# EAGLE design electricRayBot2 (EAGLE 6.4)

## Sheet 1 of 2
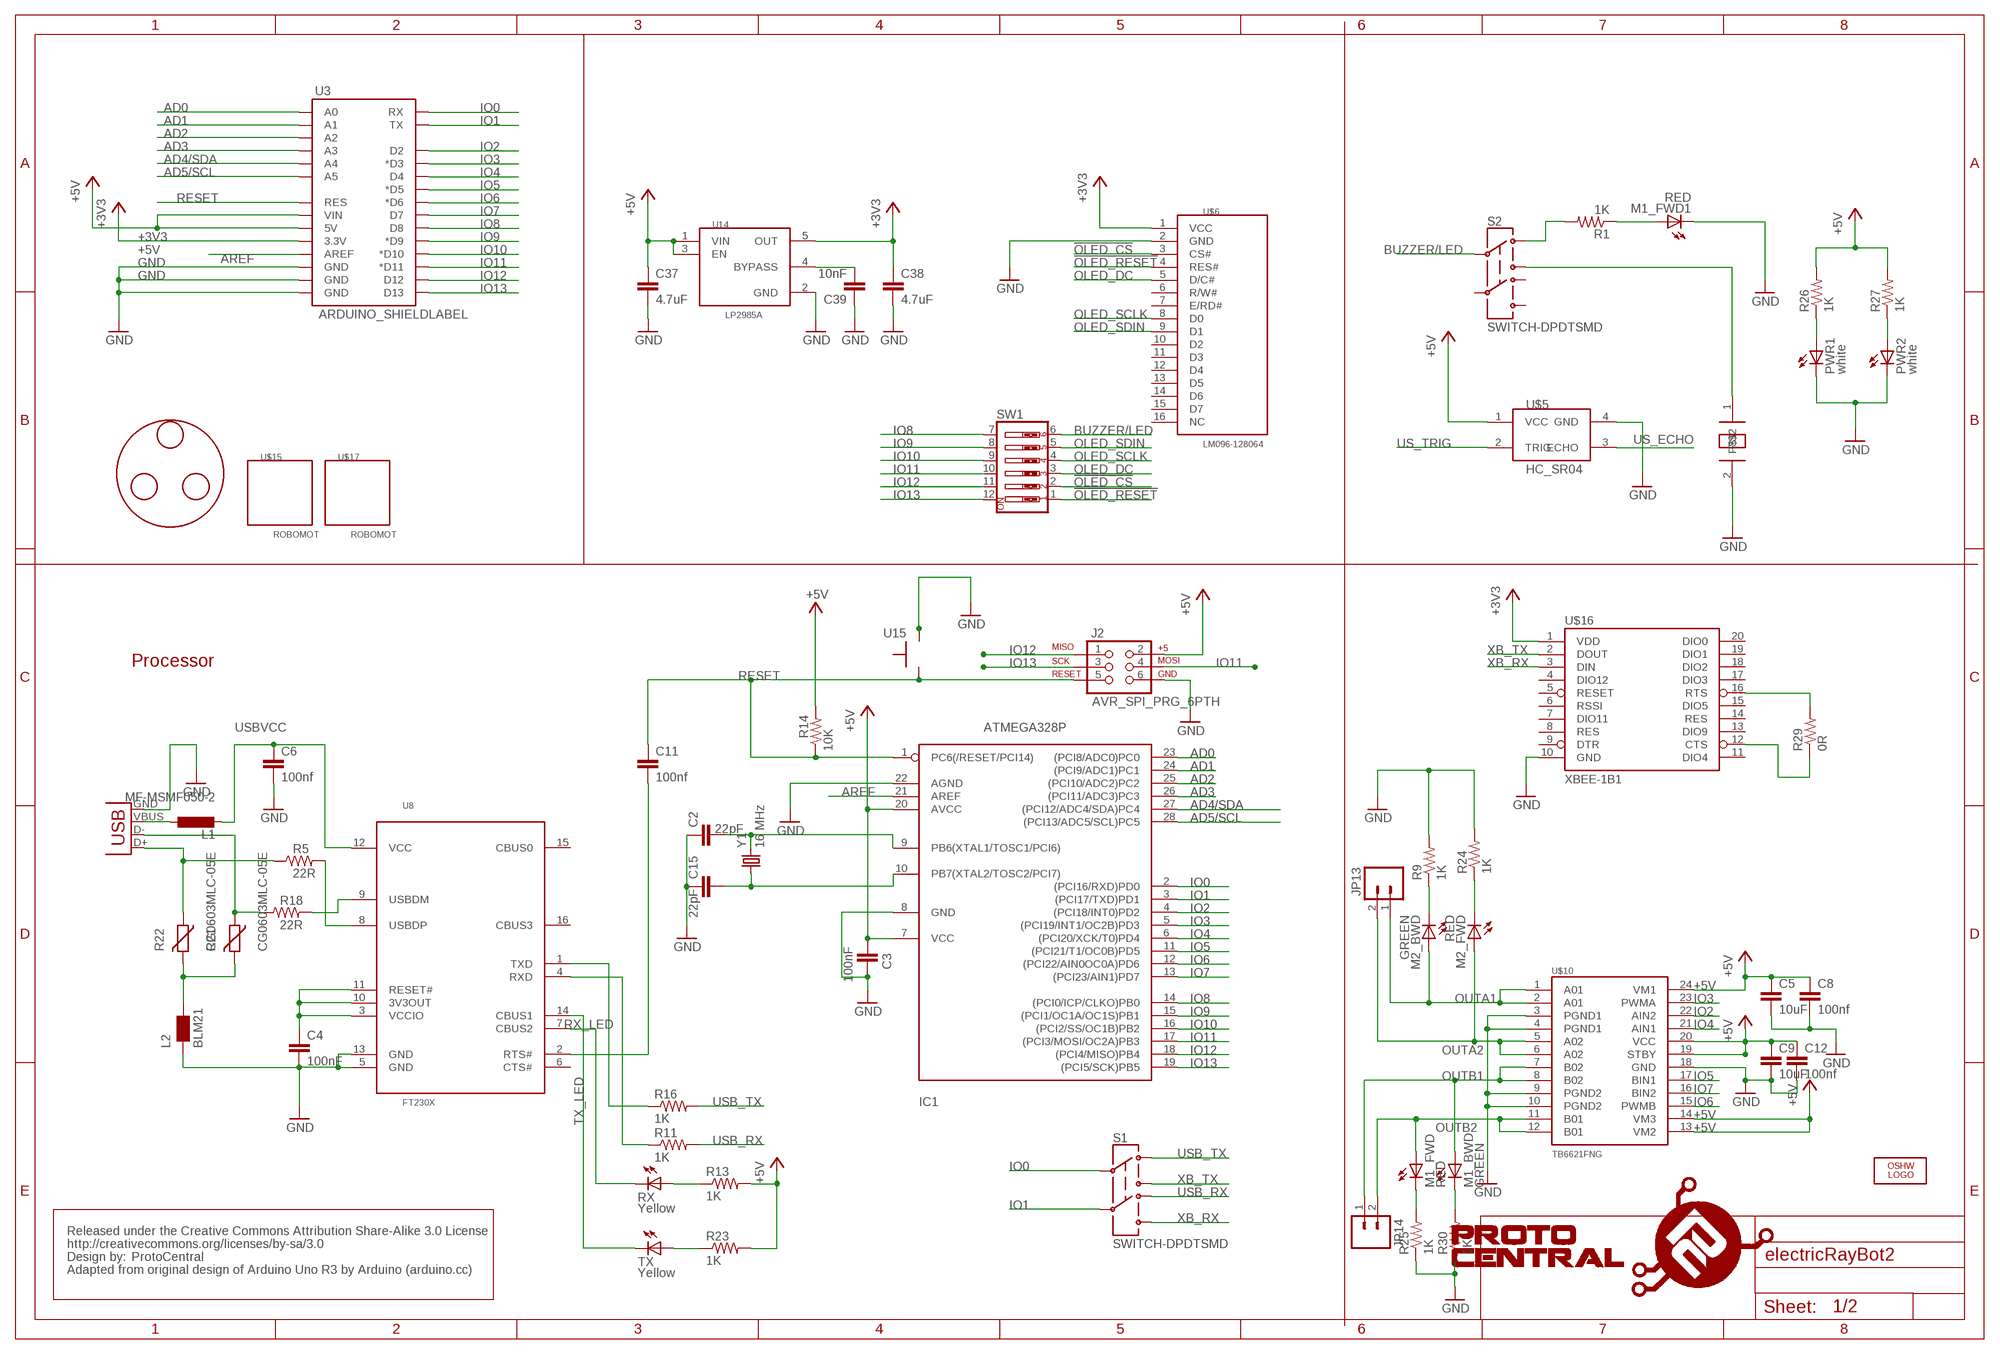
[diagram p0: schematic, sheet 1]

### Parts
C2  22pF  C-EUC0402  [C0402]
C3  100nF  C-EUC0805  [C0805]
C4  100nF  C-EUC0805  [C0805]
C5  10uF  C-EUC0805  [C0805]
C6  100nf  C-EUC0805  [C0805]
C8  100nf  C-EUC0805  [C0805]
C9  10uF  C-EUC0805  [C0805]
C11  100nf  C-EUC0805  [C0805]
C12  100nf  C-EUC0805  [C0805]
C15  22pF  C-EUC0402  [C0402]
C37  4.7uF  C-EUC0805  [C0805]
C38  4.7uF  C-EUC0805  [C0805]
C39  10nF  C-EUC0805  [C0805]
IC1  ATMEGA328P  [DIP28]
J2  AVR_SPI_PRG_6PTH  [2X3]
JP13  M023.5MM  [SCREWTERMINAL-3.5MM-2]
JP14  M023.5MM  [SCREWTERMINAL-3.5MM-2]
L1  MF-MSMF050-2  L-EUL1812  [L1812]
L2  BLM21  WE-CBF_0805  [0805]
LOGO2  OSHW_LOGO_FILLX0350-NT  [OSHW_FILLX350_NOTEXT]
M1_BWD  GREEN  LEDCHIPLED_0603  [CHIPLED_0603]
M1_FWD  RED  LEDCHIPLED_0603  [CHIPLED_0603]
M1_FWD1  RED  LEDCHIPLED_0603  [CHIPLED_0603]
M2_BWD  GREEN  LEDCHIPLED_0603  [CHIPLED_0603]
M2_FWD  RED  LEDCHIPLED_0603  [CHIPLED_0603]
PWR1  white  LED0603  [LED-0603]
PWR2  white  LED0603  [LED-0603]
R1  1K  R-US_R0805  [R0805]
R5  22R  R-US_R0805  [R0805]
R9  1K  R-US_R0805  [R0805]
R11  1K  R-US_R0805  [R0805]
R13  1K  R-US_R0805  [R0805]
R14  10K  R-US_R0805  [R0805]
R16  1K  R-US_R0805  [R0805]
R18  22R  R-US_R0805  [R0805]
R21  CG0603MLC-05E  VARISTORCN0603  [CT/CN0603]
R22  CG0603MLC-05E  VARISTORCN0603  [CT/CN0603]
R23  1K  R-US_R0805  [R0805]
R24  1K  R-US_R0805  [R0805]
R25  1K  R-US_R0805  [R0805]
R26  1K  R-US_R0805  [R0805]
R27  1K  R-US_R0805  [R0805]
R29  0R  R-US_R0805  [R0805]
R30  1K  R-US_R0805  [R0805]
RX  Yellow  LEDCHIPLED_0603  [CHIPLED_0603]
S1  SWITCH-DPDTSMD  [AYZ0202]
S2  SWITCH-DPDTSMD  [AYZ0202]
SW1  SW_DIP-6  [EDG-06]
TX  Yellow  LEDCHIPLED_0603  [CHIPLED_0603]
U3  ARDUINO_SHIELDLABEL  [DUEMILANOVE_SHIELD]
U8  FT230X  [SSOP_16]
U14  LP2985A  [SOT23-5]
U15  EVQQ2  [EVQQ2]
U$1  CREATIVE_COMMONS  [CREATIVE_COMMONS]
U$4  PS1740  [PS02]
U$5  HC_SR04  [ULTRA]
U$6  LM096-128064  [LM096-128064(OLED)]
U$10  TB6621FNG  [SSOP24]
U$15  ROBOMOT  [ROBOMOT]
U$16  XBEE-1B1  [XBEE-1]
U$17  ROBOMOT  [ROBOMOT]
U$18  PROTY-LOGO  [LOGO-PROTY]
U$20  MOTO  [MOTO]
X1  USBPTH  [USB-B-PTH]
Y1  16 MHz  CRYSTALHC49US  [HC49US]

### Nets
!OLED_CS: SW1.2 U$6.3(CS#)
!OLED_RESET: SW1.1 U$6.4(RES#)
+3V3: C38.1 U3.3.3V U14.5(OUT) U$6.1(VCC) U$16.1(VDD)
+5V: C3.1 C5.1 C8.1 C9.1 C12.1 C37.1 IC1.7(VCC) IC1.20(AVCC) J2.2 R13.2 R14.2 R23.2 R26.2 R27.2 U3.5V U3.VIN U14.1(VIN) U14.3(EN) U$5.1(VCC) U$10.13(VM2) U$10.14(VM3) U$10.19(STBY) U$10.20(VCC) U$10.24(VM1) ; also sheet 2
AD0: IC1.23((PCI8/ADC0)PC0) U3.A0 ; also sheet 2
AD1: IC1.24((PCI9/ADC1)PC1) U3.A1 ; also sheet 2
AD2: IC1.25((PCI10/ADC2)PC2) U3.A2 ; also sheet 2
AD3: IC1.26((PCI11/ADC3)PC3) U3.A3 ; also sheet 2
AD4/SDA: IC1.27((PCI12/ADC4/SDA)PC4) U3.A4 ; also sheet 2
AD5/SCL: IC1.28((PCI13/ADC5/SCL)PC5) U3.A5 ; also sheet 2
AREF: IC1.21(AREF) U3.AREF
BUZZER: S2.3 U$4.1
BUZZER/LED: S2.2 SW1.6
GND: C2.1 C3.2 C4.2 C5.2 C6.2 C8.2 C9.2 C12.2 C15.1 C37.2 C38.2 C39.1 IC1.8(GND) IC1.22(AGND) J2.6 L2.1 M1_FWD1.C PWR1.C PWR2.C R9.2 R24.2 R25.1 R30.1 U3.GND@0(GND) U3.GND@1(GND) U3.GND@2(GND) U8.5(GND) U8.13(GND) U14.2(GND) U15.P$3 U$4.2 U$5.4(GND) U$6.2(GND) U$10.3(PGND1) U$10.4(PGND1) U$10.9(PGND2) U$10.10(PGND2) U$10.18(GND) U$16.10(GND) X1.GND ; also sheet 2
IO0: IC1.2((PCI16/RXD)PD0) S1.2 U3.RX
IO1: IC1.3((PCI17/TXD)PD1) S1.5 U3.TX
IO2: IC1.4((PCI18/INT0)PD2) U3.D2 U$10.22(AIN2)
IO3: IC1.5((PCI19/INT1/OC2B)PD3) U3.D3(*D3) U$10.23(PWMA)
IO4: IC1.6((PCI20/XCK/T0)PD4) U3.D4 U$10.21(AIN1)
IO5: IC1.11((PCI21/T1/OC0B)PD5) U3.D5(*D5) U$10.17(BIN1)
IO6: IC1.12((PCI22/AIN0OC0A)PD6) U3.D6(*D6) U$10.15(PWMB)
IO7: IC1.13((PCI23/AIN1)PD7) U3.D7 U$10.16(BIN2)
IO8: IC1.14((PCI0/ICP/CLKO)PB0) SW1.7 U3.D8
IO9: IC1.15((PCI1/OC1A/OC1S)PB1) SW1.8 U3.D9(*D9)
IO10: IC1.16((PCI2/SS/OC1B)PB2) SW1.9 U3.D10(*D10)
IO11: IC1.17((PCI3/MOSI/OC2A)PB3) J2.4 SW1.10 U3.D11(*D11)
IO12: IC1.18((PCI4/MISO)PB4) J2.1 SW1.11 U3.D12
IO13: IC1.19((PCI5/SCK)PB5) J2.3 SW1.12 U3.D13
N$1: PWR1.A R26.1
N$8: M1_FWD1.A R1.1
N$10: M2_BWD.C R9.1
N$11: PWR2.A R27.1
N$14: R18.2 U8.9(USBDM)
N$15: C4.1 U8.3(VCCIO) U8.10(3V3OUT) U8.11(RESET#)
N$16: R18.1 R21.1 X1.D-
N$17: R5.2 U8.8(USBDP)
N$18: L1.1 X1.VBUS
N$20: M1_FWD.C R25.2
N$23: M1_BWD.C R30.2
N$24: R29.2 U$16.16(RTS)
N$25: C39.2 U14.4(BYPASS)
N$28: R29.1 U$16.12(CTS)
N$29: M2_FWD.C R24.1
N$30: R1.2 S2.1
N$35: R16.1 U8.1(TXD)
N$37: R11.1 U8.4(RXD)
N$40: R13.1 RX.A
N$41: R23.1 TX.A
N$44: C2.2 IC1.9(PB6(XTAL1/TOSC1/PCI6)) Y1.2
N$45: C15.2 IC1.10(PB7(XTAL2/TOSC2/PCI7)) Y1.1
N$46: C11.2 U8.2(RTS#)
N$64: L2.2 R21.2 R22.2
N$73: R5.1 R22.1 X1.D+
OLED_DC: SW1.3 U$6.5(D/C#)
OLED_SCLK: SW1.4 U$6.8(D0)
OLED_SDIN: SW1.5 U$6.9(D1)
OUTA1: JP13.1 M2_BWD.A U$10.1(A01) U$10.2(A01)
OUTA2: JP13.2 M2_FWD.A U$10.5(A02) U$10.6(A02)
OUTB1: JP14.1 M1_BWD.A U$10.7(B02) U$10.8(B02)
OUTB2: JP14.2 M1_FWD.A U$10.11(B01) U$10.12(B01)
RESET: C11.1 IC1.1(PC6(/RESET/PCI14)) J2.5 R14.1 U3.RES U15.P$1
RX_LED: RX.C U8.7(CBUS2)
TX_LED: TX.C U8.14(CBUS1)
US_ECHO: U$5.3(ECHO) ; also sheet 2
US_TRIG: U$5.2(TRIG) ; also sheet 2
USB_RX: R11.2 S1.4
USB_TX: R16.2 S1.1
USBVCC: C6.1 L1.2 U8.12(VCC) ; also sheet 2
XB_RX: S1.6 U$16.3(DIN)
XB_TX: S1.3 U$16.2(DOUT)
Unconnected: S2.4 S2.5 S2.6 U8.6(CTS#) U8.15(CBUS0) U8.16(CBUS3) U$6.6(R/W#) U$6.7(E/RD#) U$6.10(D2) U$6.11(D3) U$6.12(D4) U$6.13(D5) U$6.14(D6) U$6.15(D7) U$6.16(NC) U$16.4(DIO12) U$16.5(RESET) U$16.6(RSSI) U$16.7(DIO11) U$16.8(RES) U$16.9(DTR) U$16.11(DIO4) U$16.13(DIO9) U$16.14(RES) U$16.15(DIO5) U$16.17(DIO3) U$16.18(DIO2) U$16.19(DIO1) U$16.20(DIO0)

### Notes on the sheet
- Processor
- ProtoCentral
- Adapted from original design of Arduino Uno R3 by Arduino (arduino.cc)

## Sheet 2 of 2
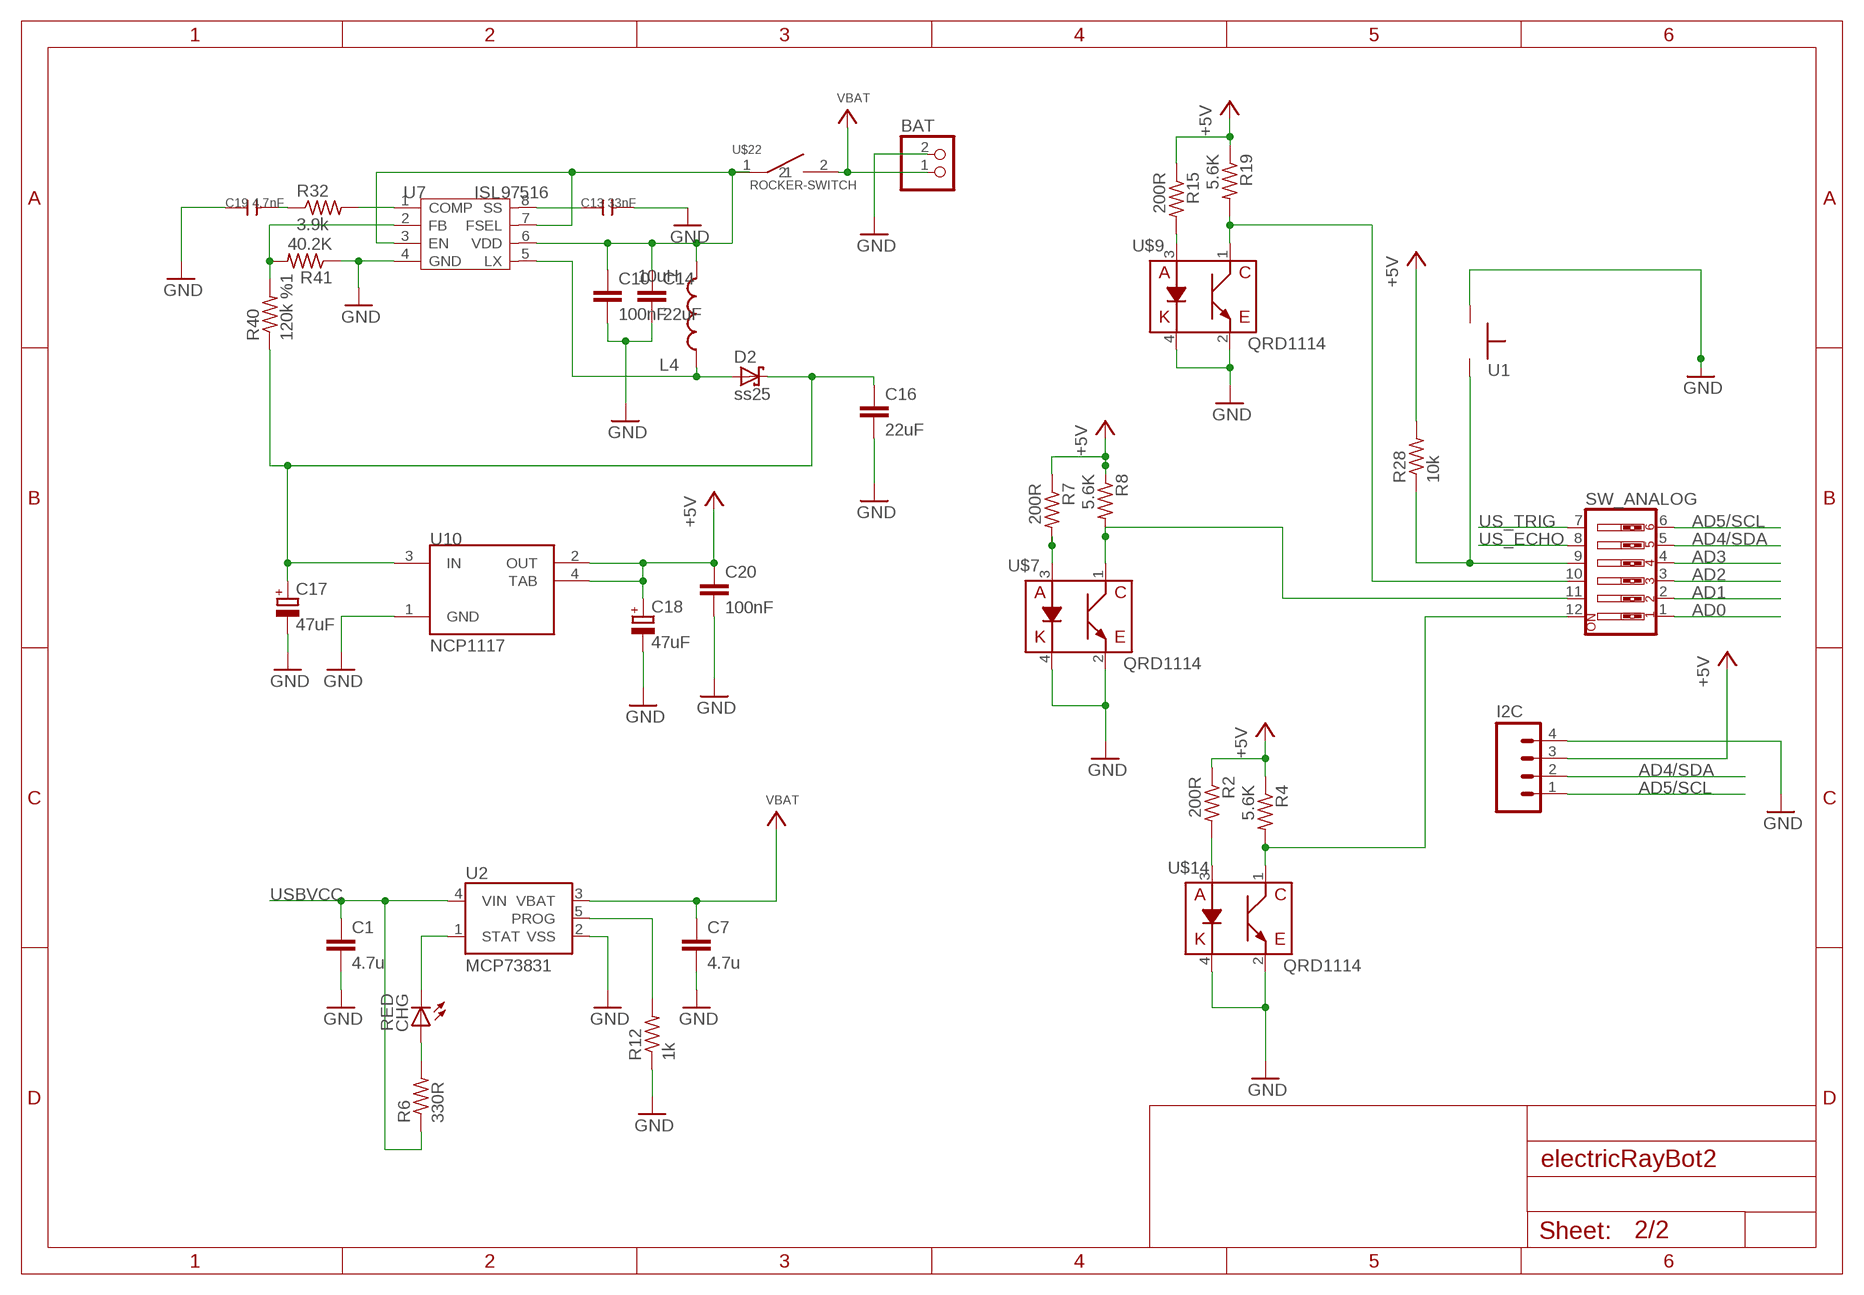
[diagram p1: schematic, sheet 2]

### Parts
BAT  JST_2PIN-THM  [JST-PH-2-THM]
C1  4.7u  C-EUC0805  [C0805]
C7  4.7u  C-EUC0805  [C0805]
C10  100nF  C-EUC0805  [C0805]
C13  33nF  C-0603  [C0603]
C14  22uF  C-EUC1206  [C1206]
C16  22uF  C-EUC1206  [C1206]
C17  47uF  CPOL-EUD  [PANASONIC_D]
C18  47uF  CPOL-EUD  [PANASONIC_D]
C19  4.7nF  C-0603  [C0603]
C20  100nF  C-EUC0402  [C0402]
CHG  RED  LEDCHIPLED_0603  [CHIPLED_0603]
D2  ss25  SCHOTTKY-DIODESMD  [SMB]
I2C  M04POLAR_LOCK  [MOLEX-1X4_LOCK]
L4  10uH  CDRH8D43  [CDRH8D43]
R2  200R  R-US_R0805  [R0805]
R4  5.6K  R-US_R0805  [R0805]
R6  330R  R-US_R0805  [R0805]
R7  200R  R-US_R0805  [R0805]
R8  5.6K  R-US_R0805  [R0805]
R12  1k  R-US_R0805  [R0805]
R15  200R  R-US_R0805  [R0805]
R19  5.6K  R-US_R0805  [R0805]
R28  10k  R-US_R0805  [R0805]
R32  3.9k  R-US_R0805  [R0805]
R40  120k %1  R-US_R0805  [R0805]
R41  40.2K  R-US_R0805  [R0805]
SW_ANALOG  SW_DIP-6  [EDG-06]
U1  EVQQ2  [EVQQ2]
U2  MCP73831  [SOT23-5]
U7  ISL97516  [MSOP8]
U10  NCP1117  [SOT223]
U$7  QRD1114  [QRD1114]
U$9  QRD1114  [QRD1114]
U$14  QRD1114  [QRD1114]
U$22  ROCKER-SWITCH  [SPST(RIGHT-ANGLE)]

### Nets
+5V: C18.+ C20.1 I2C.3 R2.1 R4.1 R7.1 R8.1 R15.1 R19.1 R28.2 U10.2(OUT) U10.4(TAB) ; also sheet 1
AD0: SW_ANALOG.1 ; also sheet 1
AD1: SW_ANALOG.2 ; also sheet 1
AD2: SW_ANALOG.3 ; also sheet 1
AD3: SW_ANALOG.4 ; also sheet 1
AD4/SDA: I2C.2 SW_ANALOG.5 ; also sheet 1
AD5/SCL: I2C.1 SW_ANALOG.6 ; also sheet 1
GND: BAT.2 C1.2 C7.2 C10.2 C13.2 C14.2 C16.2 C17.- C18.- C19.1 C20.2 I2C.4 R12.1 R41.1 U1.P$1 U2.2(VSS) U7.4(GND) U10.1(GND) U$7.2(C) U$7.4(K) U$9.2(C) U$9.4(K) U$14.2(C) U$14.4(K) ; also sheet 1
IR1: R15.2 U$9.3(A)
IR4: R7.2 U$7.3(A)
IR5: R2.2 U$14.3(A)
N$2: CHG.C U2.1(STAT)
N$3: CHG.A R6.2
N$4: R28.1 SW_ANALOG.9 U1.P$3
N$7: C16.1 C17.+ D2.C R40.1 U10.3(IN)
N$12: C13.1 U7.8(SS)
N$13: D2.A L4.P$1 U7.5(LX)
N$19: R12.2 U2.5(PROG)
N$21: R32.2 U7.1(COMP)
N$22: C19.2 R32.1
N$36: R4.2 SW_ANALOG.12 U$14.1(E)
N$39: R8.2 SW_ANALOG.11 U$7.1(E)
N$42: R40.2 R41.2 U7.2(FB)
N$43: R19.2 SW_ANALOG.10 U$9.1(E)
US_ECHO: SW_ANALOG.8 ; also sheet 1
US_TRIG: SW_ANALOG.7 ; also sheet 1
USBVCC: C1.1 R6.1 U2.4(VIN) ; also sheet 1
VBAT: BAT.1 C7.1 U2.3(VBAT) U$22.2
VDD: C10.1 C14.1 L4.P$2 U7.3(EN) U7.6(VDD) U7.7(FSEL) U$22.1

## Library data of the parts
BAT = adafruit:JST_2PIN: JST 2-Pin Connectors of various flavors SMT-RA (S2B-PH-SM4) 4UConnector #17311 SMT (B2B-PH-SM4) THM-RA (S2B-PH) THM (B2B-PH)
C1-C12 C14-C16 C20 C37-C39 = rcl:C-EU: CAPACITOR, European symbol
C13 C19 = Discrete:C*: Ceramic Capacitors
C17 C18 = rcl:CPOL-EU: POLARIZED CAPACITOR, European symbol
CHG M1_BWD M1_FWD M1_FWD1 M2_BWD M2_FWD RX TX = led:LED: LED OSRAM: - CHIPLED LG R971, LG N971, LY N971, LG Q971, LY Q971, LO R971, LY R971 LH N974, LH R974 LS Q976, LO Q976, LY Q976 LO Q996 - Hyper CHIPLED LW Q18S LB Q993, LB Q99A, LB R99A - SideLED LS A670, LO A670, LY A670, LG A670, LP A670 LB A673, LV A673, LT A673, LW A673 LH A674 LY A675 LS A676, LA A676, LO A676, LY A676, LW A676 LS A679, LY A679, LG A679 - Hyper Micro SIDELED® LS Y876, LA Y876, LO Y876, LY Y876 LT Y87S - SmartLED LW L88C, LW L88S LB L89C, LB L89S, LG L890 LS L89K, LO L89K, LY L89K LS L896, LA L896, LO L896, LY L896 - TOPLED LS T670, LO T670, LY T670, LG T670, LP T670 LSG T670, LSP T670, LSY T670, LOP T670, LYG T670 LG T671, LOG T671, LSG T671 LB T673, LV T673, LT T673, LW T673 LH T674 LS T676, LA T676, LO T676, LY T676, LB T676, LH T676, LSB T676, LW T676 LB T67C, LV T67C, LT T67C, LS T67K, LO T67K, LY T67K, LW E67C LS E67B, LA E67B, LO E67B, LY E67B, LB E67C, LV E67C, LT E67C LW T67C LS T679, LY T679, LG T679 LS T770, LO T770, LY T770, LG T770, LP T770 LB T773, LV T773, LT T773, LW T773 LH T774 LS E675, LA E675, LY E675, LS T675 LS T776, LA T776, LO T776, LY T776, LB T776 LHGB T686 LT T68C, LB T68C - Hyper Mini TOPLED® LB M676 - Mini TOPLED Santana® LG M470 LS M47K, LO M47K, LY M47K Source: http://www.osram.convergy.de LUXEON: - LUMILED® LXK2-PW12-R00, LXK2-PW12-S00, LXK2-PW14-U00, LXK2-PW14-V00 LXK2-PM12-R00, LXK2-PM12-S00, LXK2-PM14-U00 LXK2-PE12-Q00, LXK2-PE12-R00, LXK2-PE12-S00, LXK2-PE14-T00, LXK2-PE14-U00 LXK2-PB12-K00, LXK2-PB12-L00, LXK2-PB12-M00, LXK2-PB14-N00, LXK2-PB14-P00, LXK2-PB14-Q00 LXK2-PR12-L00, LXK2-PR12-M00, LXK2-PR14-Q00, LXK2-PR14-R00 LXK2-PD12-Q00, LXK2-PD12-R00, LXK2-PD12-S00 LXK2-PH12-R00, LXK2-PH12-S00 LXK2-PL12-P00, LXK2-PL12-Q00, LXK2-PL12-R00 Source: www.luxeon.com KINGBRIGHT: KA-3528ASYC Source: www.kingbright.com
D2 = diode:SCHOTTKY-DIODE: Schottky Diode
I2C = SparkFun:M04: Header 4 Standard 4-pin 0.1" header. Use with straight break away headers (SKU : PRT-00116), right angle break away headers (PRT-00553), swiss pins (PRT-00743), machine pins (PRT-00117), and female headers (PRT-00115). Molex polarized connector foot print use with SKU : PRT-08231 with associated crimp pins and housings. 1MM SMD Version SKU: PRT-10208
IC1 = circuitects:ATMEGA328P
J2 = SparkFun:AVR_SPI_PRG_6: AVR ISP 6 Pin This is the reduced ISP connector for AVR programming. Common on Arduino. This footprint will take up less PCB space and can be used with a 10-pin to 6-pin adapter such as SKU: BOB-08508
JP13 JP14 = SparkFun:M02: Header 2 Standard 2-pin 0.1" header. Use with straight break away headers (SKU : PRT-00116), right angle break away headers (PRT-00553), swiss pins (PRT-00743), machine pins (PRT-00117), and female headers (PRT-00115). Molex polarized connector foot print use with SKU : PRT-08233 with associated crimp pins and housings.
L1 = rcl:L-EU: INDUCTOR, European symbol
L2 = wuerth-elektronik:WE-CBF: SMD EMI Suppression Ferrite Beads - excellent anti-EMI properties - low DCR - impedances till 3000 ohms - rated current up to 6 A
L4 = circuitects:CDRH8D43
LOGO2 = ohw-logo:OSHW_LOGO_FILL
PWR1 PWR2 = SparkFun:LED: LEDs Standard schematic elements and footprints for 5mm, 3mm, 1206, and 0603 sized LEDs. 5mm - Spark Fun Electronics SKU : COM-00529 (and others)
R1 R2 R4-R9 R11-R16 R18 R19 R23-R30 R32 R40 R41 = rcl:R-US_: RESISTOR, American symbol
R21 R22 = varistor:VARISTOR: VARISTOR
S1 S2 = SparkFun:SWITCH-DPDT: DPDT Version of the COM-00597
SW1 SW_ANALOG = special:SW_DIP-6: DIP SWITCH
U1 U15 = circuitects:EVQQ2
U2 = SparkFun:MCP73831: Microchip's MCP73831 Miniature single cell, fully integrated Li-Ion, Li-polymer charge management controller http://ww1.microchip.com/downloads/en/DeviceDoc/21984a.pdf
U3 = SparkFun:ARDUINO_SHIELD
U7 = IC:ISL97516
U8 = circuitects:FT230X
U10 = circuitects:NCP1117
U14 = circuitects:LP2985A
U$1 = SparkFun:CREATIVE_COMMONS
U$4 = circuitects:PS1740
U$5 = circuitects:HC_SR04
U$6 = circuitects:LM096-128064
U$7 U$9 U$14 = SparkFun:QRD1114
U$10 = SparkFun:TB6621FNG: Toshiba 1A motor driver
U$15 U$17 = circuitects:ROBOMOT
U$16 = SparkFun:XBEE-1
U$18 = circuitects:PROTY-LOGO
U$20 = circuitects:MOTO
U$22 = circuitects:ROCKER-SWITCH
X1 = SparkFun:USB: USB Connectors USB-B-PTH is fully proven SKU : PRT-00139 USB-miniB is fully proven SKU : PRT-00587 USB-A-PCB is untested. USB-A-H is throughly reviewed, but untested. Spark Fun Electronics SKU : PRT-00437 USB-B-SMT is throughly reviewed, but untested. Needs silkscreen touching up. USB-A-S has not been used/tested USB-MB-H has not been used/tested
Y1 = SparkFun:CRYSTAL: Crystals Various standard crystals. Proven footprints. Spark Fun Electronics SKU : COM-00534

## Net classes
1 power: width 0.61 mm, drill 0.61 mm, clearance 0.254 mm
2 gnd: width 0.305 mm, drill 0.559 mm, clearance 0.254 mm
3 usbvcc: width 0.508 mm, drill 0.61 mm, clearance 0.254 mm
4 aref: width 0.406 mm, drill 0.61 mm, clearance 0.254 mm

## Board
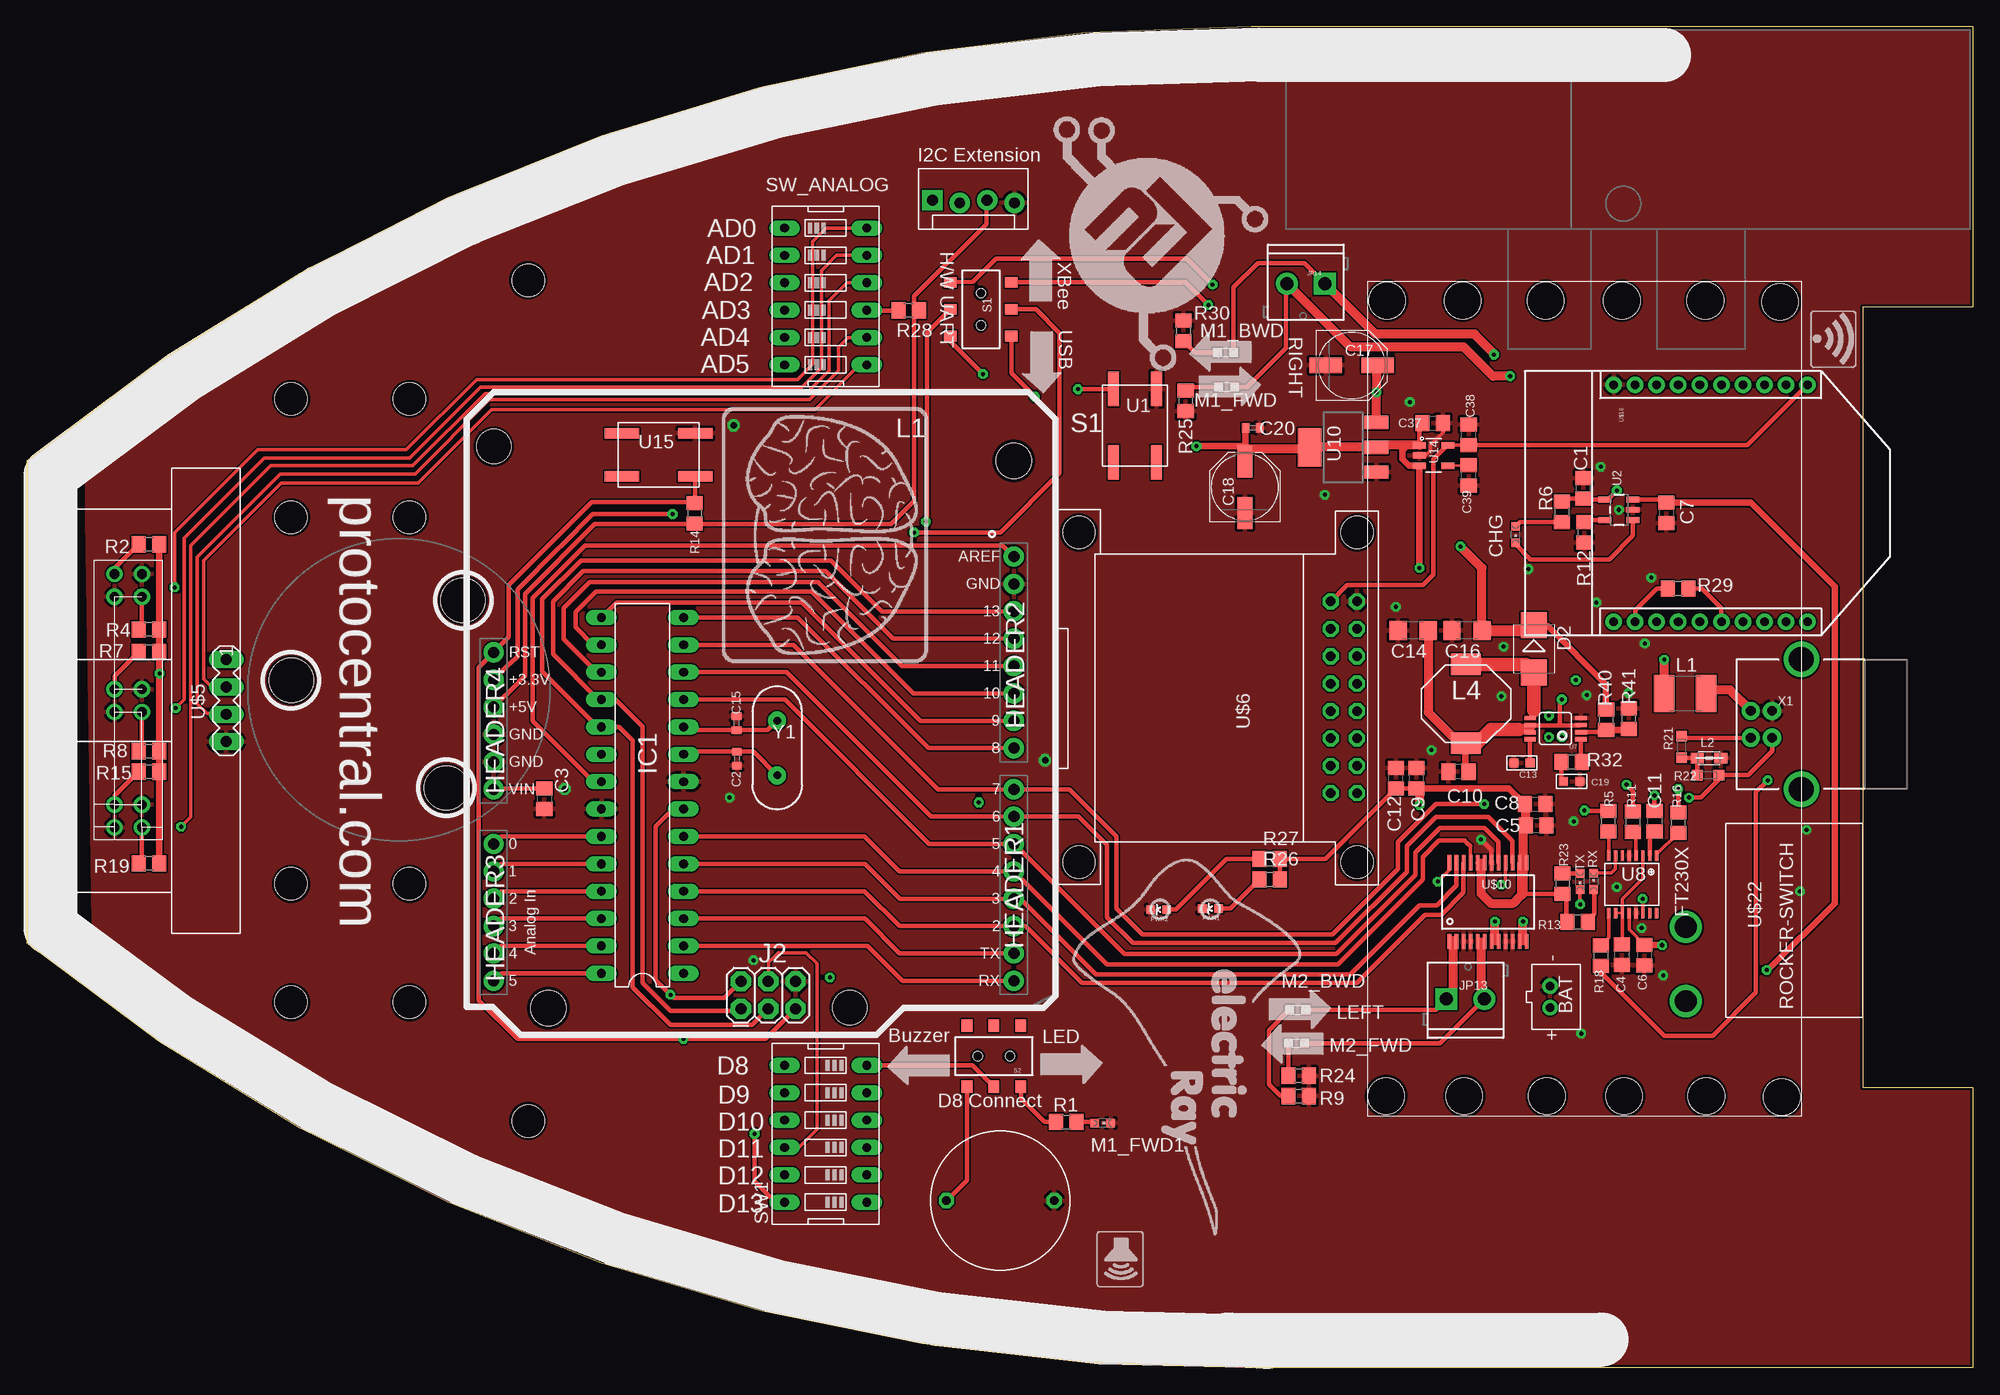
[diagram p2: board, top side]
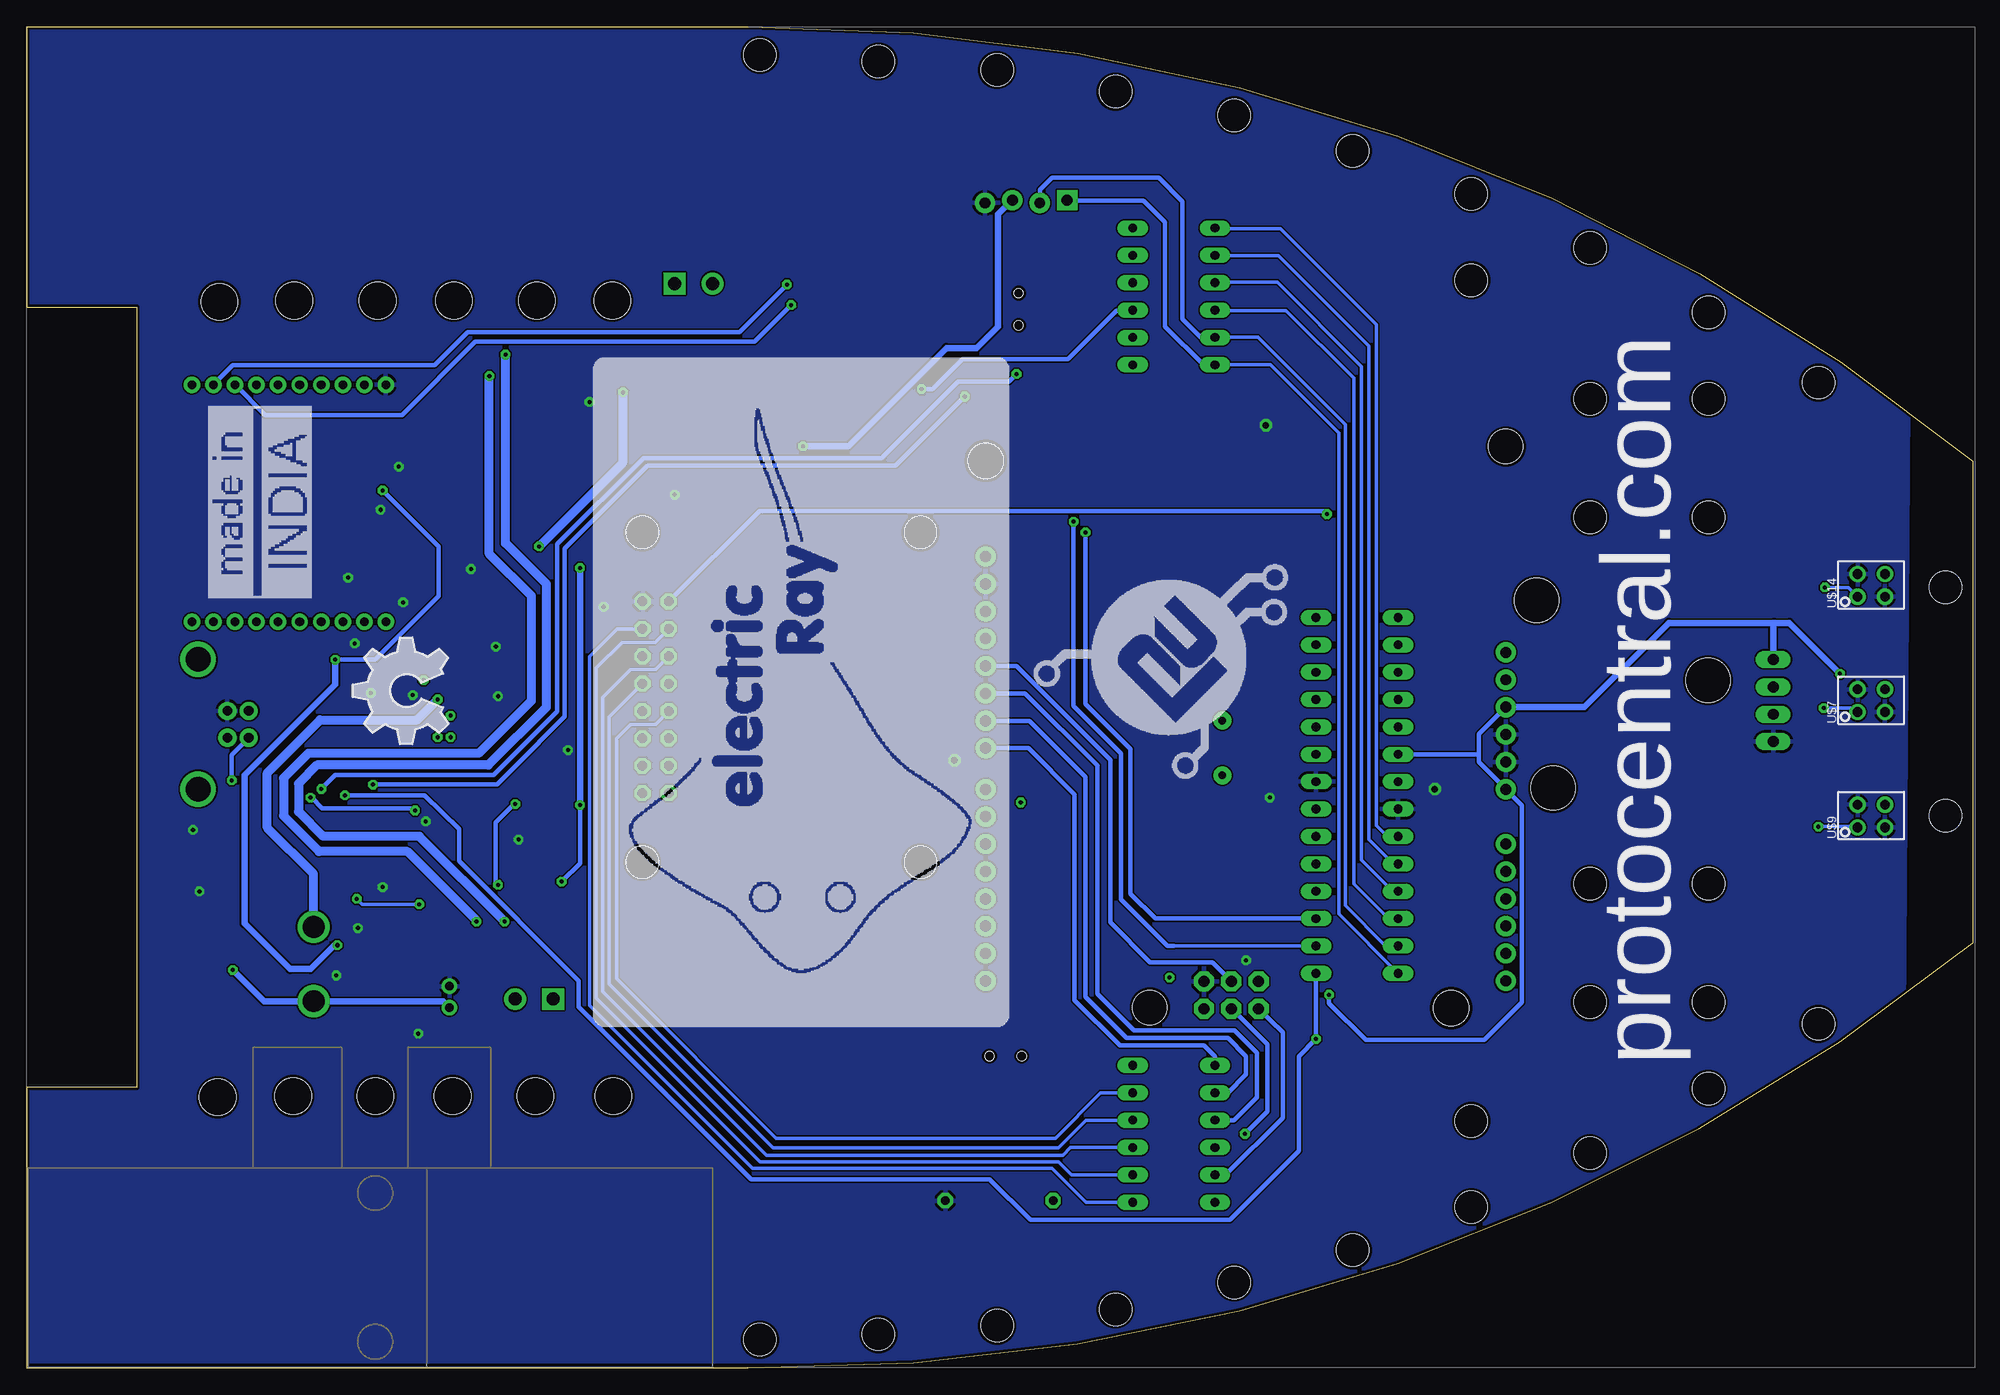
[diagram p3: board, bottom side, seen from below]

Size 180.5 x 124.4 mm. Coordinates in mm from the lower left corner, seen from the top.
Outline: 0,84.1 0,39.4 arc40 113.6,0 180.5,0 180.5,26 170.3,26 170.3,98.4 180.5,98.4 180.5,124.4 113.6,124.4 arc40 0,84.1
Copper layers (1*2*15*16): Top 0.035mm / dielectric 1.5mm / Route2 0.035mm / dielectric 0.15mm / Route15 0.035mm / dielectric 0.2mm / Bottom 0.035mm
Design rules "Circuitects-Rules-8mil *": minimum track width 6mil, minimum drill 15mil, track to track 6mil, track to pad 6mil, pad to pad 6mil, via to via 6mil, smd to smd 6mil, copper to edge 10mil, drill to drill 8mil, minimum pad ring 12mil, minimum via ring 10mil, stop-mask expansion 4mil, vias tented up to drill 25mil, thermal gap 10mil
Holes 3 mm at 35.5,103.9 57.5,112.9 79.5,118.4 112.5,121.8 14.3,91.4 14.3,31.9 35.5,19.9 57.5,10.9 79.5,5.4 112.5,2.6 24.5,97.9 46.5,108.9 68.5,116.2 90.5,120.4 101.5,121.2 24.5,25.9 46.5,14.9 68.5,7.9 90.5,3.9 2.5,72.4 2.5,51.2 101.5,3.1 24.5,78.9 24.5,44.9 24.5,33.9 24.5,89.9 35.5,33.9 35.5,89.9 35.5,44.9 35.5,78.9 46.5,100.9 46.5,22.9
Holes 3.2 mm at 76.32,33.41 43.3,85.48
Holes 3.4 mm at 126.1,25.2 162.8,25.1 133.2,99 126.2,99 148.17,25.2 133.34,25.2 147.97,99 162.64,98.9

### Footprints (pad centres in the part's own frame; a part is rotated, then mirrored left to right if it is on the bottom)
JST-PH-2-THM = drill 0.8 pad 1.422: 1 1,0; 2 -1,0
C0805 = smd 1.3 x 1.5: 1 -0.95,0; 2 0.95,0
C0402 = smd 0.7 x 0.9: 1 -0.65,0; 2 0.65,0
C0603 = smd 0.889 x 0.889: 1 -0.762,0; 2 0.762,0
C1206 = smd 1.6 x 1.8: 1 -1.4,0; 2 1.4,0
PANASONIC_D = smd 3 x 1.4: + 2.4,0; - -2.4,0
CHIPLED_0603 = smd 0.8 x 0.8: A 0,-0.75; C 0,0.75
SMB = smd 2.4 x 2.4: A 2.2,0; C -2.2,0
MOLEX-1X4_LOCK = drill 1.016 pad 1.88 square: 1 0,0.127 | drill 1.016 pad 1.88: 2 2.54,-0.127; 3 5.08,0.127; 4 7.62,-0.127
DIP28 = drill 0.813 long: 1 -16.51,-3.81; 2 -13.97,-3.81; 3 -11.43,-3.81; 4 -8.89,-3.81; 5 -6.35,-3.81; 6 -3.81,-3.81; 7 -1.27,-3.81; 8 1.27,-3.81; 9 3.81,-3.81; 10 6.35,-3.81; 11 8.89,-3.81; 12 11.43,-3.81; 13 13.97,-3.81; 14 16.51,-3.81; 15 16.51,3.81; 16 13.97,3.81; 17 11.43,3.81; 18 8.89,3.81; 19 6.35,3.81; 20 3.81,3.81; 21 1.27,3.81; 22 -1.27,3.81; 23 -3.81,3.81; 24 -6.35,3.81; 25 -8.89,3.81; 26 -11.43,3.81; 27 -13.97,3.81; 28 -16.51,3.81
2X3 = drill 1.016 pad 1.88 octagon: 1 0,0; 2 0,2.54; 3 2.54,0; 4 2.54,2.54; 5 5.08,0; 6 5.08,2.54
SCREWTERMINAL-3.5MM-2 = drill 1.2 pad 2.032 square: 1 0,0 | drill 1.2 pad 2.032: 2 3.5,0
L1812 = smd 1.9 x 3.4: 1 -1.95,0; 2 1.95,0
0805 = smd 1.2 x 1: 1 -1.1,0; 2 1.1,0
CDRH8D43 = smd 2 x 2.8: P$1 -3.65,0; P$2 3.65,0
LED-0603 = smd 0.8 x 0.8: A 0,-0.75; C 0,0.75
R0805 = smd 1.3 x 1.5: 1 -0.95,0; 2 0.95,0
CT/CN0603 = smd 1 x 1: 1 -1,0; 2 1,0
AYZ0202 = smd 1 x 1.15: 1 -2.5,2.825; 2 0,2.825; 3 2.5,2.825; 4 -2.5,-2.825; 5 0,-2.825; 6 2.5,-2.825 | hole 0.85: 1.5,0; -1.5,0
EDG-06 = drill 0.813 long: 1 -6.35,-3.81; 2 -3.81,-3.81; 3 -1.27,-3.81; 4 1.27,-3.81; 5 3.81,-3.81; 6 6.35,-3.81; 7 6.35,3.81; 8 3.81,3.81; 9 1.27,3.81; 10 -1.27,3.81; 11 -3.81,3.81; 12 -6.35,3.81
EVQQ2 = smd 3.2 x 1: P$1 -3.4,2; P$2 3.4,2; P$3 -3.4,-2; P$4 3.4,-2
SOT23-5 = smd 0.55 x 1.2: 1 -0.95,-1.3; 2 0,-1.3; 3 0.95,-1.3; 4 0.95,1.3; 5 -0.95,1.3
DUEMILANOVE_SHIELD = drill 1.016 pad 1.88: 3.3V 50.8,26.67; 5V 50.8,29.21; A0 50.8,41.91; A1 50.8,44.45; A2 50.8,46.99; A3 50.8,49.53; A4 50.8,52.07; A5 50.8,54.61; AREF 2.54,15.24; D2 2.54,49.53; D3 2.54,46.99; D4 2.54,44.45; D5 2.54,41.91; D6 2.54,39.37; D7 2.54,36.83; D8 2.54,33.02; D9 2.54,30.48; D10 2.54,27.94; D11 2.54,25.4; D12 2.54,22.86; D13 2.54,20.32; GND@0 50.8,31.75; GND@1 50.8,34.29; GND@2 2.54,17.78; RES 50.8,24.13; RX 2.54,54.61; TX 2.54,52.07; VIN 50.8,36.83 | hole 3.302: 45.72,57.15; 2.54,6.35
MSOP8 = smd 0.4 x 1.1: 1 -0.975,-2.35; 2 -0.325,-2.35; 3 0.325,-2.35; 4 0.975,-2.35; 5 0.975,2.35; 6 0.325,2.35; 7 -0.325,2.35; 8 -0.975,2.35
SSOP_16 = smd 0.305 x 0.991: 1 -2.286,-2.667; 2 -1.651,-2.667; 3 -1.016,-2.667; 4 -0.381,-2.667; 5 0.254,-2.667; 6 0.889,-2.667; 7 1.524,-2.667; 8 2.159,-2.667; 9 2.159,2.667; 10 1.524,2.667; 11 0.889,2.667; 12 0.254,2.667; 13 -0.381,2.667; 14 -1.016,2.667; 15 -1.651,2.667; 16 -2.286,2.667
SOT223 = smd 1.219 x 2.235: 1 -2.311,-3.099; 2 0,-3.099; 3 2.311,-3.099 | smd 3.6 x 2.2: 4 0,3.099
SOT23-5' = smd 0.6 x 1.2: 1 -0.95,-1.306; 2 0,-1.306; 3 0.95,-1.306; 4 0.95,1.306; 5 -0.95,1.306
PS02 = drill 0.8 octagon: 1 -5,0; 2 5,0
ULTRA = drill 1.016 long: 1 -3.81,0; 2 -1.27,0; 3 1.27,0; 4 3.81,0
LM096-128064(OLED) = drill 0.88 octagon: 1 -10.46,-8.89; 2 -12.9,-8.89; 3 -10.46,-6.35; 4 -12.9,-6.35; 5 -10.46,-3.81; 6 -12.9,-3.81; 7 -10.46,-1.27; 8 -12.9,-1.27; 9 -10.46,1.27; 10 -12.9,1.27; 11 -10.46,3.81; 12 -12.9,3.81; 13 -10.46,6.35; 14 -12.9,6.35; 15 -10.46,8.89; 16 -12.9,8.89 | hole 3: -12.9,-15.3; 12.9,-15.3; 12.9,15.3; -12.9,15.3
QRD1114 = drill 0.9: 1 -1.067,1.27; 2 -1.067,-1.27; 3 1.041,-1.27; 4 1.041,1.27
SSOP24 = smd 0.348 x 1.397: 1 -3.575,-3.656; 2 -2.925,-3.656; 3 -2.275,-3.656; 4 -1.625,-3.656; 5 -0.975,-3.656; 6 -0.325,-3.656; 7 0.325,-3.656; 8 0.975,-3.656; 9 1.625,-3.656; 10 2.275,-3.656; 11 2.925,-3.656; 12 3.575,-3.656; 13 3.575,3.656; 14 2.925,3.656; 15 2.275,3.656; 16 1.625,3.656; 17 0.975,3.656; 18 0.325,3.656; 19 -0.325,3.656; 20 -0.975,3.656; 21 -1.625,3.656; 22 -2.275,3.656; 23 -2.925,3.656; 24 -3.575,3.656
ROBOMOT = hole 3.4: 20.9,15.9; 6.1,15.9
XBEE-1 = drill 0.8 pad 1.524: 1 -11,20; 2 -11,18; 3 -11,16; 4 -11,14; 5 -11,12; 6 -11,10; 7 -11,8; 8 -11,6; 9 -11,4; 10 -11,2; 11 11,2; 12 11,4; 13 11,6; 14 11,8; 15 11,10; 16 11,12; 17 11,14; 18 11,16; 19 11,18; 20 11,20
MOTO = hole 4.1: 0,10; -8.7,-5.2; 8.8,-5.2
SPST(RIGHT-ANGLE) = drill 2: 1 9.6,-3.7; 2 16.5,-3.7
USB-B-PTH = drill 0.914 pad 1.676: D+ 0,1.25; D- 1.981,1.25; GND 0,-1.25; VBUS 1.981,-1.25 | drill 2.286: S1 -2.718,-6.02; S2 -2.718,6.02
HC49US = drill 0.7 pad 1.651: 1 -2.54,0; 2 2.54,0

### Placement (x,y rotation side)
BAT  141.3,34.4 270 top
C1  144.4,81.6 90 top
C2  65.87,56.52 90 top
C3  48,52.8 270 top
C4  147.95,38.32 270 top
C5  140,50.3 0 top
C6  150.06,38.29 270 top
C7  152.1,79.3 270 top
C8  139.9,52.3 0 top
C9  128.9,54.7 90 top
C10  132.8,55.3 180 top
C11  151,50.7 270 top
C12  127,54.7 90 top
C13  138.7,56.1 180 top
C14  128.6,68.4 180 top
C15  65.83,59.8 270 top
C16  133.6,68.4 180 top
C17  122.9,93 0 top
C18  113,81.7 90 top
C19  143.3,54.4 180 top
C20  113.7,87.2 0 top
C37  130.4,87.65 0 top
C38  133.75,86.55 90 top
C39  133.75,82.8 90 top
CHG  138.1,77.3 180 top
D2  139.8,66.7 270 top
I2C  84,108.2 0 top
IC1  57.1,53.1 90 top
J2  66.23,33.3 0 top
JP13  131.7,34.2 0 top
JP14  120.4,100.6 180 top
L1  153.85,62.55 180 top
L2  156.05,56.55 180 top
L4  133.5,61.6 270 top
LOGO2  141.4,57.86 90 bottom
M1_BWD  111.2,94.2 90 top
M1_FWD  111.3,91 90 top
M1_FWD1  99.8,22.7 270 top
M2_BWD  117.9,33.2 90 top
M2_FWD  117.8,30.1 90 top
PWR1  109.8,42.6 90 top
PWR2  105,42.5 90 top
R1  96.4,22.8 180 top
R2  11.3,76.4 180 top
R4  11.3,68.5 180 top
R5  146.7,50.72 270 top
R6  142.4,79.4 270 top
R7  11.3,66.4 180 top
R8  11.3,57.2 180 top
R9  118,25.2 0 top
R11  148.98,50.64 90 top
R12  144.5,77.5 90 top
R13  143.88,41.36 180 top
R14  61.95,79.27 270 top
R15  11.3,55.3 180 top
R16  153.19,50.56 90 top
R18  146.02,38.25 90 top
R19  11.3,46.8 180 top
R21  153.5,57.59 270 top
R22  155.97,54.98 180 top
R23  142.46,44.91 270 top
R24  118,27.1 0 top
R25  107.5,89.7 90 top
R26  115.3,45.3 0 top
R27  115.3,47.2 0 top
R28  81.8,98.1 0 top
R29  153.2,72.3 0 top
R30  107.3,96.2 270 top
R32  143.3,56.2 0 top
R40  146.5,60.1 270 top
R41  148.6,60.2 270 top
RX  145.35,45.12 0 top
S1  88.5,98.2 90 top
S2  89.7,28.9 180 top
SW1  74.1,21.7 90 top
SW_ANALOG  74.1,99.4 270 top
TX  144.08,45.11 180 top
U1  102.8,87.4 270 top
U2  147.7,79.6 90 top
U3  94.1,90.5 180 top
U7  141.8,59.3 90 top
U8  148.9,44.85 180 top
U10  122.1,85.4 90 top
U14  LP2985A  [SOT23-5']  130.5,84.65 270 top
U15  58.6,84.7 180 top
U$1  6.86,18.96 0 top
U$2  [MADEININDIA]  154.2,71.5 90 bottom
U$3  [BMP-SPEAKER]  98.9,13 270 top
U$4  90.3,15.5 0 top
U$5  18.5,61.9 270 top
U$6  110.5,62.2 180 top
U$7  9.4,61.9 90 bottom
U$9  9.4,51.2 90 bottom
U$10  135.55,43.2 0 top
U$11  [BMP-ELECTRICRAY]  86.7,28.4 90 bottom
U$13  [PROTY-LOGO-LARGE]  63.3,74.9 180 bottom
U$14  9.4,72.6 90 bottom
U$15  161.8,114.9 180 top
U$16  145.2,80.2 270 top
U$17  161.9,9.3 0 bottom
U$18  -14.1,-8.9 0 top  (outside the outline)
U$19  [BMP-WIRELESS]  165.1,98.5 270 top
U$20  34.5,62.9 85 top
U$21  [BMP-BRAIN]  60.5,90 270 top
U$22  157.6,50.5 270 top
U$36  [PROTY-LOGO-LARGE]  94.9,116.3 270 top
U$37  [LOGO-ELECTRICRAY]  97,47.2 270 top
X1  161.9,59.7 180 top
Y1  69.6,57.5 270 top

### Tracks (layer width: path | path; a pad name or v marks a point on that pad's centre or on a via)
!OLED_CS
  Bottom 0.305: U$6.3 122.21,67.3 125.3,67.3 127.7,64.9 127.7,34.3 112.5,19.1 84.8,19.1 83.59,17.89 SW1.2
!OLED_RESET
  Bottom 0.305: U$6.4 125.75,68.55 128.3,66 128.3,33.6 113.2,18.5 85.4,18.5 82.25,15.35 SW1.1
+3V3  (via drill 0.38)
  Top 0.305: C38.1 U14.5
  Top 0.406: U3.3.3V 44.8,65.33 44.83,65.33 45.5,66 45.5,72.2 49.3,76 49.6,76.3 52.5,79.2 v59.9,79.2 | C38.1 159.6,85.6 U$16.1 | U14.5 130.5,84.3 130.5,73.6 129.5,72.6 122.47,72.6 U$6.1
  Bottom 0.406: U$6.1 112.55,79.5 60.2,79.5 v59.9,79.2
+5V  (via drill 0.38)
  Top 0.152: 82.3,98.6 82.75,98.6 R28.2 | U14.3 129.2,83.6 | 129.2,53.6 128.9,53.6 C9.1
  Top 0.305: U$10.24 131.97,46.17 v130.9,45.1 | U$10.13 U$10.14
  Top 0.406: U$10.20 U$10.19 134.9,46.86 134.9,46.8 | J2.2 64.69,34.3 60,34.3 v59.7,34.6 58.3,36 58.3,50.2 59.93,51.83 IC1.7 | U14.1 129.19,87.39 C37.1 | 128.4,53.6 128.55,53.75 C9.1 C12.1 120.45,47.2 R27.2 R26.2 | U3.5V 45.6,63.59 45.6,63.6 46.2,64.2 46.2,71.8 52.67,78.27 62,78.27 | C3.1 43.38,53.75 U3.VIN | 138.65,43.85 138.76,43.96 R23.2 142.46,43.94 142.8,43.6 142.8,41.49 R13.2 | 62,78.27 R14.2 | I2C.3 89,108.25 89,106.1 82.3,99.4 82.3,98.6 | 62,78.27 80.17,78.27 82.3,80.4 82.3,97.65 R28.2 | 112.9,85.5 113.05,85.5 | C18.+ 113,85.1 | 113.05,85.15 113.2,85.15 113.2,85.3 | 138.8,44 138.47,44 U$10.14
  Top 0.61: U14.1 128.1,85.6 127.6,85.1 127.6,84.3 128.2,83.7 U14.3 | C20.1 113.05,85.5 113.05,85.15 113,85.1 | C9.1 137.5,53.75 C8.1 | 129.2,83.6 v129.2,74.2 | R19.1 R15.1 R8.1 12.25,64.35 v12.3,64.4 12.25,64.45 R7.1 R4.1 R2.1 | 112.9,85.5 v108.5,85.5
  Top 0.813: U14.1 125.4,85.6 U10.2 119.6,85.4 | 119.6,85.4 U10.4 | 113.2,85.3 119.5,85.3 119.6,85.4 | 134.9,46.8 134.9,44 135.8,43.1 137.9,43.1 138.65,43.85 138.8,44 138.8,49.8 139.05,50.05 C5.1 139.05,52.2 C8.1 | 129.2,53.6 v129.2,52.2
  Bottom 0.406: v59.7,34.6 59.7,33.8 56.3,30.4 45.3,30.4 41.8,33.9 41.8,52.17 U3.VIN 43.3,53.7 45.8,56.2 45.8,56.9 | 45.8,56.9 45.8,58.79 U3.5V | IC1.20 45.81,56.91 45.8,56.9 | v129.2,52.2 129.2,46.8 v130.9,45.1
  Bottom 0.61: v129.2,74.2 v129.2,52.2 | U3.5V 36.01,61.29 28.2,69.1 18.4,69.1 | v12.3,64.4 17,69.1 18.4,69.1 | v108.5,85.5 104.3,85.5 95.2,94.6 92.4,94.6 90.4,96.6 90.4,107.01 I2C.3 | U$5.1 18.5,69 18.4,69.1
AD0
  Top 0.406: IC1.23 44,49.29 U3.A0
  Bottom 0.305: IC1.23 54.19,49.29 arc45 54.36,49.36 55.3,50.3 55.3,96.8 64.2,105.7 69.44,105.7 SW_ANALOG.1
AD1
  Top 0.406: IC1.24 44,46.75 U3.A1
  Bottom 0.305: IC1.24 53.65,46.75 arc45 53.82,46.82 56,49 56,94.8 64.4,103.2 69.48,103.2 SW_ANALOG.2
AD2
  Top 0.406: IC1.25 44,44.21 U3.A2
  Bottom 0.305: IC1.25 53.7,44.21 arc45 53.88,44.28 56.7,47.1 56.7,92.9 64.5,100.7 69.46,100.7 SW_ANALOG.3
AD3
  Top 0.406: IC1.26 44,41.67 U3.A3
  Bottom 0.305: IC1.26 54.06,41.67 arc45 54.24,41.74 57.4,44.9 57.4,91.8 63.7,98.1 69.46,98.1 SW_ANALOG.4
AD4/SDA
  Top 0.406: IC1.27 44,39.13 U3.A4
  Bottom 0.305: IC1.27 54.33,39.13 arc45 54.5,39.2 58.2,42.9 58.2,87.5 66.3,95.6 69.48,95.6 SW_ANALOG.5
  Bottom 0.406: SW_ANALOG.5 71.59,95.59 73.3,97.3 73.3,108.2 75.5,110.4 85.4,110.4 86.5,109.3 86.5,108.11 I2C.2
AD5/SCL
  Top 0.406: IC1.28 44,36.59 U3.A5
  Bottom 0.305: IC1.28 58.8,42.1 58.8,86.7 65.15,93.05 SW_ANALOG.6
  Bottom 0.406: SW_ANALOG.6 71.35,93.05 74.9,96.6 74.9,106.3 76.9,108.3 83.97,108.3 I2C.1
AREF
  Top 0.406: IC1.21 52.53,54.37 46.9,60 46.9,71.4 51.8,76.3 90.52,76.3 U3.AREF
BUZZER
  Top 0.406: S2.3 87.2,17.4 U$4.1
BUZZER/LED
  Top 0.406: SW1.6 87.72,28.05 S2.2
GND  (via drill 0.38, 0.61)
  Top 0.305: U14.2 129.75,84.65 130.2,85.1 130.2,85.6 131.4,86.8 131.4,87.6 C37.2
  Top 0.406: U$10.18 135.88,48.02 v134.9,49
  other vias: 147.5,44.6 164.5,44.2 151.8,36.4 165.1,49.9 143.5,50.7 94.46,56.36 49.9,53.69 65.57,87.44 120.4,81 149.8,40.8 146,83.6 147.7,79.6 144.2,31 67.4,37.8 65.2,52.9 148.6,62.6 150.7,73.3 136.8,62.3 130.3,57.3 127,70.6 137,66.9 144.7,62.4 145.6,71 150.1,67.2 139.3,74.1 128.3,89.6
  pour Top: 5.8,127.4 183.2,127.85 183,-0.1 6.9,-2.3 5.6,78.8
  pour Bottom: 5.7,127.7 183.2,127.8 183.3,0.6 6.6,0.6
IO0  (via drill 0.38)
  Top 0.406: IC1.2 77.97,39.13 81.21,35.89 U3.RX | v83.4,78.5 83.5,78.6 83.5,96.03 S1.2
  Bottom 0.305: 74.4,39.13 74.1,39.13 IC1.2
  Bottom 0.406: v83.4,78.5 83.4,61.4 79,57 79,43.43 74.7,39.13 74.1,39.13
IO1  (via drill 0.38)
  Top 0.406: U3.TX 80.97,38.43 77.73,41.67 IC1.3 | S1.5 93.6,98.2 95.8,96 95.8,83 90.3,77.5 v82.3,77.5
  Bottom 0.406: v82.3,77.5 82.3,61.6 78.1,57.4 78.1,43.97 75.8,41.67 IC1.3
IO2
  Top 0.406: IC1.4 77.69,44.21 80.93,40.97 U3.D2 92.63,40.97 97.9,35.7 123.4,35.7 129.7,42 131.2,42 133.28,44.07 U$10.22
IO3
  Top 0.406: IC1.5 77.75,46.75 80.99,43.51 U3.D3 92.19,43.51 99.2,36.5 122.8,36.5 129.2,42.9 130.8,42.9 132.62,44.73 U$10.23
IO4
  Top 0.305: U$10.21 133.93,48.38 133.55,48.75
  Top 0.406: IC1.6 77.71,49.29 80.95,46.05 U3.D4 100.2,37.4 121.6,37.4 129.5,45.3 129.5,47.4 131,48.9 133.4,48.9 133.55,48.75 133.9,48.4
IO5
  Top 0.406: IC1.11 70.31,61.99 83.71,48.59 U3.D5 91.61,48.59 101.8,38.4 121.5,38.4 128.8,45.7 128.8,47.8 131.1,50.1 135.2,50.1 136.53,48.77 U$10.17
IO6
  Top 0.406: IC1.12 70.47,64.53 83.87,51.13 U3.D6 97.57,51.13 100.2,48.5 100.2,41.8 102.6,39.4 121.4,39.4 128,46 128,48.4 130.7,51.1 135.6,51.1 137.82,48.88 U$10.15
IO7  (via drill 0.38)
  Top 0.305: U$10.16 137.18,45.17 v136.8,44.8
  Top 0.406: IC1.13 71.13,67.07 84.53,53.67 U3.D7 96.73,53.67 101.1,49.3 101.1,42.6 103.5,40.2 121.1,40.2 127.2,46.3 127.2,48.8 130.7,52.3 v135.2,52.3
  Bottom 0.406: v135.2,52.3 135.3,52.3 137,50.6 137,45 v136.8,44.8
IO8
  Top 0.406: IC1.14 71.49,69.61 83.62,57.48 U3.D8
  Bottom 0.406: SW1.7 70.29,28.89 71.3,29.9 79.1,29.9 83.3,34.1 83.3,53.18 87.6,57.48 U3.D8
IO9
  Top 0.254: IC1.15 53.31,69.61
  Top 0.406: 53.31,69.61 54.7,71 71.9,71 82.88,60.02 U3.D9
  Bottom 0.406: SW1.8 69.09,25.51 67.4,27.2 67.4,28.9 69.1,30.6 78.5,30.6 82.3,34.4 82.3,54.82 87.5,60.02 U3.D9
IO10
  Top 0.406: IC1.16 52.53,67.07 50.9,68.7 50.9,70.1 52.8,72 72.8,72 82.24,62.56 U3.D10
  Bottom 0.406: SW1.9 68.53,22.97 66.4,25.1 66.4,29.2 68.5,31.3 77.8,31.3 81.2,34.7 81.2,55.86 87.9,62.56 U3.D10
IO11
  Top 0.305: SW1.10 71.63,20.43 73.3,22.1 73.3,37.5 72.3,38.5 69.7,38.5 68.8,37.6 68.8,35.87 J2.4
  Top 0.406: IC1.17 52.87,64.53 49.8,67.6 49.8,70.5 52.2,72.9 73.4,72.9 81.2,65.1 U3.D11
  Bottom 0.406: U3.D11 88.7,65.1 80,56.4 80,41.3 76.3,37.6 70.53,37.6 J2.4
IO12
  Top 0.406: U3.D12 80.36,67.64 74.1,73.9 51.6,73.9 48.8,71.1 48.8,66.2 53.01,61.99 IC1.18 54.61,61.99 57.1,59.5 57.1,35.7 59.7,33.1 66.03,33.1 J2.1
  Bottom 0.406: SW1.11 69.31,17.89 64,23.2 64,31.1 65.17,32.27 65.2,32.27 J2.1
IO13  (via drill 0.38)
  Top 0.406: U3.D13 79.32,70.18 74.6,74.9 51.4,74.9 47.8,71.3 47.8,64.6 52.95,59.45 IC1.19 54.95,59.45 56.2,58.2 56.2,35.3 59.7,31.8 67.27,31.8 J2.3 | v67.5,21.7 67.5,17.3 69.4,15.4 70.24,15.4 SW1.12
  Bottom 0.406: J2.3 68.7,33.3 65.4,30 65.4,23.8 v67.5,21.7
IR1
  Top 0.406: U$9.3 8.13,53.08 R15.2
IR4
  Top 0.406: U$7.3 8.13,64.18 R7.2
IR5
  Top 0.406: U$14.3 8.13,74.18 R2.2
N$1
  Top 0.406: PWR1.A 111.65,42.6 R26.1
N$2
  Top 0.406: CHG.C 138.1,76.4 139.5,75 146.8,75 149,77.2 U2.1 | U2.1
N$3
  Top 0.406: R6.2 138.5,78.45 CHG.A
N$4  (via drill 0.38)
  Top 0.406: R28.1 77.94,98.1 SW_ANALOG.9 | U1.P$3 v97.5,90.8
  Bottom 0.406: v97.5,90.8 96.5,90.8 93.7,93.6 83.9,93.6 79.4,98.1 77.94,98.1 SW_ANALOG.9
N$6  (via drill 0.38)
  other vias: 74.5,36.2
N$7  (via drill 0.38)
  Top 0.61: R40.1 146.5,63.4 141.1,68.8 139.9,68.8 D2.C
  Top 0.813: U10.3 v125.2,90.5 125.2,92.8 C17.+ | C16.1 135,74.2 v133,76.2
  Top 1.016: C16.1 139.3,68.4 D2.C
  Bottom 0.813: v125.2,90.5 125.2,90 125.2,84 v133,76.2
N$8
  Top 0.406: R1.1 98.95,22.8 M1_FWD1.A
N$9  (via drill 0.38)
  other vias: 141.2,58.5
N$10
  Top 0.406: M2_BWD.C 117.1,33.2 115.2,31.3 115.2,26.3 116.3,25.2 R9.1
N$11
  Top 0.406: PWR2.A 106.6,42.5 111.3,47.2 R27.1
N$12
  Top 0.406: U7.8 139.45,56.11 C13.1
N$13
  Top 0.406: 139.8,61 139.8,60.62 U7.5
  Top 1.27: L4.P$1 139.05,65.25 D2.A 139.8,61
N$14
  Top 0.305: U8.9 146.74,39.92 R18.2
N$15
  Top 0.254: U8.10 U8.11 148,42.19 | 148.01,39.33 C4.1
  Top 0.305: U8.11 148.01,39.33 | U8.3 149.92,45.42 148,43.5 148,42.19
N$16  (via drill 0.38)
  Top 0.406: X1.D- 153.64,58.45 R21.1 | R18.1 146.02,36.68 151.9,30.8 156.4,30.8 160.4,34.8 160.4,53.4 v161.5,54.5
  Bottom 0.406: v161.5,54.5 161.5,56.87 X1.D-
N$17
  Top 0.305: U8.8 146.74,49.73 R5.2
N$18
  Top 0.813: X1.VBUS 159.92,60.98 158,62.9 156.15,62.9 L1.1
N$19
  Top 0.406: U2.5 144.7,78.65 R12.2
N$20
  Top 0.406: M1_FWD.C 107.85,91 R25.2
N$21
  Top 0.406: U7.1 144.15,56.3 R32.2
N$22
  Top 0.406: R32.1 142.35,54.59 C19.2
N$23
  Top 0.406: M1_BWD.C 108.35,94.2 R30.2
N$24
  Top 0.406: U$16.16 157.2,70.5 155.4,72.3 R29.2
N$25
  Top 0.254: U14.4 133.6,83.7 C39.2
N$26  (via drill 0.4)
  other vias: 88.3,52.45
N$27  (via drill 0.38)
  other vias: 143.7,63.8
N$28
  Top 0.406: U$16.12 149.2,70.3 151.2,72.3 R29.1
N$29
  Top 0.406: R24.1 M2_FWD.C
N$30
  Top 0.406: S2.1 92.2,25 94.4,22.8 R1.2
N$31  (via drill 0.38)
  other vias: 142.4,58.5
N$32  (via drill 0.38)
  other vias: 141.2,60.5
N$35
  Top 0.305: U8.1 151.19,47.61 R16.1
N$36  (via drill 0.38)
  Top 0.305: SW_ANALOG.12 74.15,105.75 72.9,104.5 72.9,93.1 71.5,91.7 41.7,91.7 35.2,85.2 21.4,85.2 13.7,77.5 v13.7,72.4
  Top 0.406: U$14.1 10.67,68.82 R4.2
  Bottom 0.305: v13.7,72.4 11.54,72.4 U$14.1
N$37
  Top 0.254: 149.28,49.39 R11.1
  Top 0.305: U8.4 149.28,49.39
N$39  (via drill 0.38)
  Top 0.305: SW_ANALOG.11 75.11,103.21 73.7,101.8 73.7,92.8 71.9,91 42.1,91 35.5,84.4 22,84.4 14.6,77 14.6,62 v13.8,61.2
  Top 0.406: U$7.1 10.67,57.52 R8.2
  Bottom 0.305: v13.8,61.2 11.04,61.2 U$7.1
N$40
  Top 0.406: R13.1 144.83,41.53 145.4,42.1 145.4,44.32 RX.A
N$41
  Top 0.406: R23.1 TX.A
N$42
  Top 0.406: U7.2 146.32,58.98 R40.2
  Top 0.61: R40.2 148.5,59.15 R41.2
N$43  (via drill 0.38)
  Top 0.305: SW_ANALOG.10 76.07,100.67 74.4,99 74.4,92.5 72.3,90.4 42.5,90.4 35.8,83.7 22.6,83.7 15.2,76.3 15.2,51.1 v14.3,50.2
  Top 0.406: U$9.1 10.67,47.12 R19.2
  Bottom 0.305: v14.3,50.2 10.74,50.2 U$9.1
N$44
  Top 0.406: Y1.2 67.39,57.17 C2.2 61.17,57.17 IC1.9
N$45
  Top 0.406: Y1.1 68.71,59.15 C15.2 61.21,59.15 IC1.10
N$46
  Top 0.406: U8.2 150.55,49.3 C11.2
N$64
  Top 0.406: R22.2 154.95,55 L2.2 153.54,56.55 R21.2
N$73  (via drill 0.38)
  Top 0.406: X1.D+ 161.9,57.2 159.7,55 156.99,55 R22.1 156.97,54.57 155.3,52.9 v154.2,52.9 | R5.1 144.53,51.67 v144.5,51.7
  Bottom 0.406: v154.2,52.9 154.1,52.9 153.1,51.9 144.7,51.9 v144.5,51.7
OLED_DC
  Bottom 0.305: U$6.5 122.17,64.8 124.5,64.8 127.1,62.2 127.1,34.9 111.9,19.7 84.4,19.7 83.67,20.43 SW1.3
OLED_SCLK
  Bottom 0.305: U$6.8 126.5,60.37 126.5,35.6 111.3,20.4 84.8,20.4 82.23,22.97 SW1.4
OLED_SDIN
  Bottom 0.305: U$6.9 122.19,59.7 124.5,59.7 125.8,58.4 125.8,36.1 111,21.3 85.1,21.3 80.89,25.51 SW1.5
OUTA1
  Top 0.254: U$10.2 U$10.1 131.97,39.6 132.3,39.6
  Top 0.406: M2_BWD.A 130.7,33.2 JP13.1
  Top 0.813: 132.3,39.6 132.3,34.8 JP13.1
OUTA2
  Top 0.254: U$10.6 134.9,39.54 134.9,39.4
  Top 0.305: U$10.6 U$10.5
  Top 0.406: M2_FWD.A 131.1,30.1 JP13.2
  Top 0.813: 134.9,39.5 134.9,39.4 134.9,34.5 JP13.2
OUTB1  (via drill 0.38)
  Top 0.254: U$10.7 U$10.8 136.53,39.6 136.2,39.6
  Top 0.406: M1_BWD.A 111.95,100.25 114.2,102.5 118.5,102.5 JP14.1
  Top 0.813: 136.2,39.6 v136.2,41.4 | v136.1,94 136.1,94.1 134.3,95.9 125.1,95.9 JP14.1
  Bottom 0.813: v136.2,41.4 144.1,49.3 153,49.3 155.3,51.6 155.3,54.2 153.6,55.9 137.7,55.9 132.3,61.3 132.3,72.7 136.1,76.5 v136.1,94
OUTB2  (via drill 0.38)
  Top 0.254: U$10.11 U$10.12 139.12,39.6 138.8,39.6
  Top 0.406: M1_FWD.A 113.2,91 116.8,94.6 116.8,100.5 JP14.2
  Top 0.813: 138.8,39.6 v138.8,41.4 | v137.6,92 136,92 133.3,94.7 122.8,94.7 JP14.2
  Bottom 0.813: v138.8,41.4 138.8,41.5 145.2,47.9 153.4,47.9 156.7,51.2 156.7,54.7 154.4,57 138.6,57 133.7,61.9 133.7,71.6 137.6,75.5 v137.6,92
RESET  (via drill 0.38)
  Top 0.406: J2.5 68.51,30.5 v60.9,30.5 45.5,30.5 41.9,34.1 41.9,64.97 U3.RES 43.3,66.4 44.7,67.8 44.7,72.6 52.4,80.3 61.87,80.3 R14.1 62,80.27 U15.P$1 | C11.1 v151,53.1
  Bottom 0.406: IC1.1 v60.91,30.51 v60.9,30.5 62.5,28.9 62.5,20.1 68.9,13.7 87.4,13.7 91.2,17.5 113.3,17.5 129.3,33.5 129.3,35.9 140.4,47 140.4,50 143.6,53.1 v151,53.1
RX_LED
  Top 0.305: U8.7 147.38,46.28 147,45.9 145.38,45.9 RX.C
TX_LED  (via drill 0.38)
  Top 0.305: U8.14 149.92,43.48 v149.9,43.5 | TX.C 144.08,43.02 v144.1,43
  Bottom 0.305: v144.1,43 149.4,43 v149.9,43.5
US_ECHO
  Top 0.305: SW_ANALOG.8 76.19,95.59 75.3,94.7 75.3,92.5 72.6,89.8 42.9,89.8 36,82.9 23.5,82.9 15.8,75.2 15.8,61.6 16.7,60.7 18.43,60.7 U$5.3
US_TRIG
  Top 0.305: SW_ANALOG.7 77.25,93.05 73.1,88.9 43.1,88.9 36.3,82.1 23.6,82.1 16.4,74.9 16.4,63.9 17.1,63.2 18.47,63.2 U$5.2
USB_RX  (via drill 0.38)
  Top 0.406: S1.4 91.33,92.28 v93.5,90.1 | R11.2 148.98,53.52 v148.4,54.1
  Bottom 0.406: v93.5,90.1 99.9,83.7 122.9,83.7 130.6,76 130.6,60.4 135.35,55.65 135.8,55.2 136.9,54.1 v148.4,54.1
USB_TX  (via drill 0.38)
  Top 0.406: R16.2 153.19,52.91 v153.2,53.7 | S1.1 85.67,95.23 v88.7,92.2
  Bottom 0.406: v88.7,92.2 89.4,91.5 94.1,91.5 101.2,84.4 123.3,84.4 131.3,76.4 131.3,60.9 137.2,55 151.9,55 v153.2,53.7
USBVCC  (via drill 0.38)
  Top 0.305: U8.12 148.65,40.65 C6.1
  Top 0.406: R6.1 142.7,80.65 C1.1 144.5,80.55 U2.4 146.65,80.55 v147.5,81.4
  Top 0.61: C6.1 151.56,39.24 v151.7,39.2
  Top 0.813: L1.2 v151.9,65.7
  Bottom 0.406: v147.5,81.4 142.3,76.2 142.3,71.6 148.2,65.7 v151.9,65.7
  Bottom 0.61: v151.7,39.2 152,39.2 154.2,37 156.1,37 160.3,41.2 160.3,55 151.9,63.4 v151.9,65.7
VBAT  (via drill 0.38)
  Top 0.406: 152.6,80.55 C7.1 151.8,80.55 U2.3
  Top 0.61: C7.1 159.95,80.25 167.7,72.5 167.7,43.1 161.5,36.9 v161.4,36.9
  Bottom 0.61: v161.4,36.9 158.5,34 U$22.2 141.9,34 BAT.1
VDD  (via drill 0.38)
  Top 0.152: 139.6,59.3 139.45,59.3 U7.6 | U7.3 144.1,59.62 144.1,59.6
  Top 0.203: U7.7 139.45,59.25 139.4,59.3
  Top 0.406: U7.7 U7.6 | 139.6,59.3 139.9,59.6 142.2,59.6 | 142.2,59.6 144.1,59.6 | 142.2,59.6 142.2,61.8 v142.4,62
  Top 0.61: 133.45,57.9 133.45,55.6 C10.1
  Top 0.813: C14.1 130,60.8 132.9,57.9 133.45,57.9 L4.P$2 | 139.4,59.3 138.1,59.3 138,59.2
  Top 1.27: L4.P$2 134.55,57.95 135.8,59.2 138,59.2 138.4,59.2
  Bottom 0.813: v142.4,62 144.3,60.1 153.3,60.1 158.2,55.2 158.2,50.1 153.9,45.8 U$22.1
XB_RX  (via drill 0.38)
  Top 0.406: S1.6 107.5,100.7 v109.6,98.6
  Bottom 0.406: v109.6,98.6 113,95.2 138.9,95.2 145.7,88.4 158.4,88.4 U$16.3
XB_TX  (via drill 0.38)
  Top 0.406: S1.3 87.78,100.78 89.9,102.9 107.6,102.9 v110,100.5
  Bottom 0.406: v110,100.5 114.4,96.1 139.6,96.1 142.7,93 161.4,93 U$16.2

### Text on the board
tPlace: I2C Extension | AD0 | H/W UART | XBee | AD1 | AD2 | AD3 | USB | RIGHT | AD4 | AD5 | L1 | S1 | U14 | protocentral.com | L4 | HEADER2 | HEADER4 | HEADER1 | J2 | HEADER3 | LEFT | Buzzer | LED | D8 | D9 | D8 Connect | D10 | D11 | D12 | D13
bPlace: protocentral.com